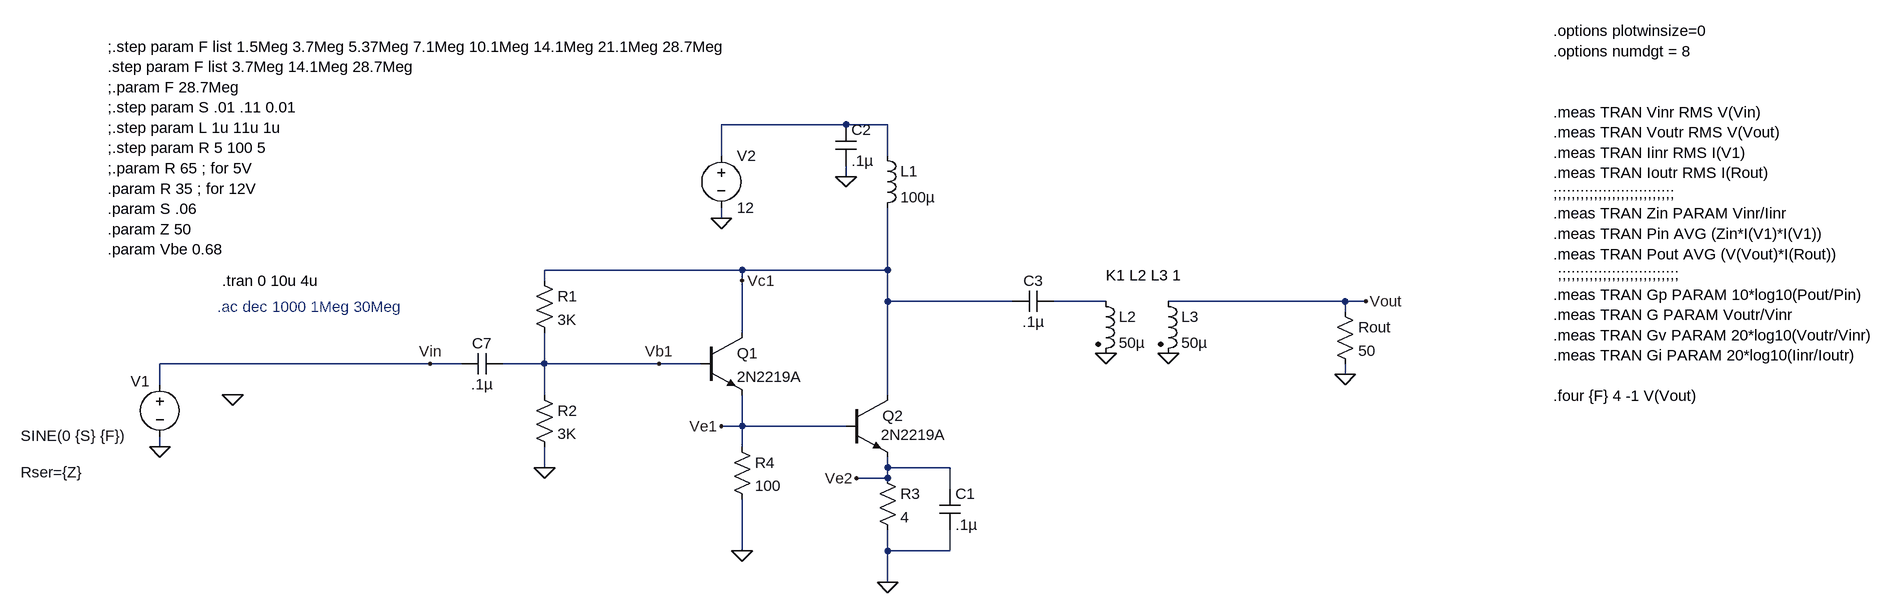
[diagram p0: schematic 2N2219 Darlington testing.asc]
2N2219 Darlington testing.asc, the LTspice schematic file:
Version 4
SHEET 1 2764 1496
WIRE 576 -176 384 -176
WIRE 640 -176 576 -176
WIRE 384 -128 384 -176
WIRE 640 -128 640 -176
WIRE 576 -96 576 -112
WIRE 384 -32 384 -48
WIRE 416 48 112 48
WIRE 640 48 640 -48
WIRE 640 48 416 48
WIRE 112 64 112 48
WIRE 416 64 416 48
WIRE 640 96 640 48
WIRE 832 96 640 96
WIRE 976 96 896 96
WIRE 1344 96 1072 96
WIRE 1376 96 1344 96
WIRE 1344 112 1344 96
WIRE 416 144 416 64
WIRE -64 192 -480 192
WIRE -16 192 -64 192
WIRE 112 192 112 144
WIRE 112 192 48 192
WIRE 288 192 112 192
WIRE 352 192 288 192
WIRE 1344 208 1344 192
WIRE -480 224 -480 192
WIRE 112 240 112 192
WIRE 640 240 640 96
WIRE 416 288 416 240
WIRE 416 288 384 288
WIRE 576 288 416 288
WIRE -480 320 -480 304
WIRE 416 320 416 288
WIRE 112 352 112 320
WIRE 640 352 640 336
WIRE 736 352 640 352
WIRE 640 368 640 352
WIRE 640 368 592 368
WIRE 736 384 736 352
WIRE 416 480 416 400
WIRE 640 480 640 448
WIRE 736 480 736 448
WIRE 736 480 640 480
WIRE 640 528 640 480
FLAG 384 -32 0
FLAG -480 320 0
FLAG 416 480 0
FLAG 1376 96 Vout
FLAG 1344 208 0
FLAG 288 192 Vb1
FLAG 384 288 Ve1
FLAG -64 192 Vin
FLAG 416 64 Vc1
FLAG 640 528 0
FLAG 592 368 Ve2
FLAG 576 -96 0
FLAG -368 240 0
FLAG 976 176 0
FLAG 1072 176 0
FLAG 112 352 0
SYMBOL voltage -480 208 R0
WINDOW 0 -45 11 Left 2
WINDOW 3 -214 95 Left 2
WINDOW 123 -214 123 Left 2
WINDOW 39 -214 151 Left 2
SYMATTR InstName V1
SYMATTR Value SINE(0 {S} {F})
SYMATTR SpiceLine Rser={Z}
SYMBOL voltage 384 -144 R0
WINDOW 123 0 0 Left 0
WINDOW 39 0 0 Left 0
SYMATTR InstName V2
SYMATTR Value 12
SYMBOL res 96 48 R0
SYMATTR InstName R1
SYMATTR Value 3K
SYMBOL res 400 304 R0
SYMATTR InstName R4
SYMATTR Value 100
SYMBOL cap 896 80 R90
WINDOW 0 0 32 VBottom 2
WINDOW 3 32 32 VTop 2
SYMATTR InstName C3
SYMATTR Value .1µ
SYMBOL res 1328 96 R0
SYMATTR InstName Rout
SYMATTR Value 50
SYMBOL cap 48 176 R90
WINDOW 0 0 32 VBottom 2
WINDOW 3 32 32 VTop 2
SYMATTR InstName C7
SYMATTR Value .1µ
SYMBOL npn 352 144 R0
SYMATTR InstName Q1
SYMATTR Value 2N2219A
SYMBOL npn 576 240 R0
WINDOW 3 54 61 Left 2
SYMATTR Value 2N2219A
SYMATTR InstName Q2
SYMBOL res 624 352 R0
SYMATTR InstName R3
SYMATTR Value 4
SYMBOL cap 720 384 R0
SYMATTR InstName C1
SYMATTR Value .1µ
SYMBOL ind 624 -144 R0
SYMATTR InstName L1
SYMATTR Value 100µ
SYMBOL cap 560 -176 R0
SYMATTR InstName C2
SYMATTR Value .1µ
SYMBOL ind2 960 80 R0
SYMATTR InstName L2
SYMATTR Value 50µ
SYMATTR Type ind
SYMBOL ind2 1056 80 R0
SYMATTR InstName L3
SYMATTR Value 50µ
SYMATTR Type ind
SYMBOL res 96 224 R0
SYMATTR InstName R2
SYMATTR Value 3K
TEXT -384 64 Left 2 !.tran 0 10u 4u
TEXT 1664 -320 Left 2 !.options plotwinsize=0\n.options numdgt = 8\n \n \n.meas TRAN Vinr RMS V(Vin)\n.meas TRAN Voutr RMS V(Vout)\n.meas TRAN Iinr RMS I(V1)\n.meas TRAN Ioutr RMS I(Rout)\n;;;;;;;;;;;;;;;;;;;;;;;;;;;\n.meas TRAN Zin PARAM Vinr/Iinr\n.meas TRAN Pin AVG (Zin*I(V1)*I(V1))\n.meas TRAN Pout AVG (V(Vout)*I(Rout))\n ;;;;;;;;;;;;;;;;;;;;;;;;;;;\n.meas TRAN Gp PARAM 10*log10(Pout/Pin)\n.meas TRAN G PARAM Voutr/Vinr\n.meas TRAN Gv PARAM 20*log10(Voutr/Vinr)\n.meas TRAN Gi PARAM 20*log10(Iinr/Ioutr)\n \n.four {F} 4 -1 V(Vout)
TEXT -560 -296 Left 2 !;.step param F list 1.5Meg 3.7Meg 5.37Meg 7.1Meg 10.1Meg 14.1Meg 21.1Meg 28.7Meg\n.step param F list 3.7Meg 14.1Meg 28.7Meg\n;.param F 28.7Meg\n;.step param S .01 .11 0.01\n;.step param L 1u 11u 1u\n;.step param R 5 100 5\n;.param R 65 ; for 5V\n.param R 35 ; for 12V\n.param S .06\n.param Z 50\n.param Vbe 0.68
TEXT -392 104 Left 2 ;.ac dec 1000 1Meg 30Meg
TEXT 976 56 Left 2 !K1 L2 L3 1

The netlist it stands for:
* 2N2219 Darlington testing.asc
V1 Vin 0 SINE(0 {S} {F}) Rser={Z}
V2 N001 0 12
R1 Vc1 Vb1 3K
R4 Ve1 0 100
C3 N002 Vc1 .1µ
Rout Vout 0 50
C7 Vb1 Vin .1µ
Q1 Vc1 Vb1 Ve1 0 2N2219A
Q2 Vc1 Ve1 Ve2 0 2N2219A
R3 Ve2 0 4
C1 Ve2 0 .1µ
L1 N001 Vc1 100µ
C2 N001 0 .1µ
L2 N002 0 50µ
L3 Vout 0 50µ
R2 Vb1 0 3K
.model NPN NPN
.model PNP PNP
.lib standard.bjt
.tran 0 10u 4u
.options plotwinsize=0
.options numdgt = 8
.meas TRAN Vinr RMS V(Vin)
.meas TRAN Voutr RMS V(Vout)
.meas TRAN Iinr RMS I(V1)
.meas TRAN Ioutr RMS I(Rout)
;;;;;;;;;;;;;;;;;;;;;;;;;;;
.meas TRAN Zin PARAM Vinr/Iinr
.meas TRAN Pin AVG (Zin*I(V1)*I(V1))
.meas TRAN Pout AVG (V(Vout)*I(Rout))
 ;;;;;;;;;;;;;;;;;;;;;;;;;;;
.meas TRAN Gp PARAM 10*log10(Pout/Pin)
.meas TRAN G PARAM Voutr/Vinr
.meas TRAN Gv PARAM 20*log10(Voutr/Vinr)
.meas TRAN Gi PARAM 20*log10(Iinr/Ioutr)
.four {F} 4 -1 V(Vout)
;.step param F list 1.5Meg 3.7Meg 5.37Meg 7.1Meg 10.1Meg 14.1Meg 21.1Meg 28.7Meg
.step param F list 3.7Meg 14.1Meg 28.7Meg
;.param F 28.7Meg
;.step param S .01 .11 0.01
;.step param L 1u 11u 1u
;.step param R 5 100 5
;.param R 65 ; for 5V
.param R 35 ; for 12V
.param S .06
.param Z 50
.param Vbe 0.68
* .ac dec 1000 1Meg 30Meg
K1 L2 L3 1
.backanno
.end